# EAGLE schematic main (EAGLE 6.1)
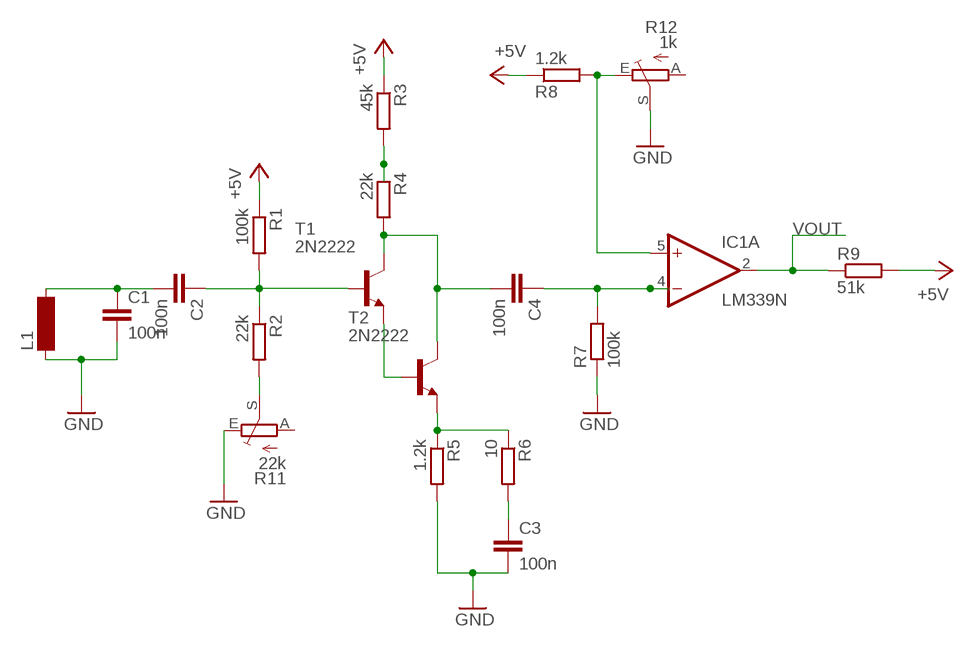
[diagram p0: schematic, sheet 1]

## Parts
C1  100n  C-EU025-024X044  [C025-024X044]
C2  100n  C-EU025-024X044  [C025-024X044]
C3  100n  C-EU025-024X044  [C025-024X044]
C4  100n  C-EU025-024X044  [C025-024X044]
IC1  LM339N  [DIL14]
L1  BS11  [BS11]
R1  100k  R-EU_0204/2V  [0204V]
R2  22k  R-EU_0204/2V  [0204V]
R3  45k  R-EU_0204/2V  [0204V]
R4  22k  R-EU_0204/2V  [0204V]
R5  1.2k  R-EU_0204/2V  [0204V]
R6  10  R-EU_0204/2V  [0204V]
R7  100k  R-EU_0204/2V  [0204V]
R8  1.2k  R-EU_0204/2V  [0204V]
R9  51k  R-EU_0204/2V  [0204V]
R11  22k  TRIM_EU-B25P  [B25P]
R12  1k  TRIM_EU-B25P  [B25P]
T1  2N2222  [TO18]
T2  2N2222  [TO18]

## Nets
+5V: R1.1 R3.1 R8.1 R9.2
GND: C1.2 C3.2 L1.1 R5.2 R7.1 R11.E R12.S
N$1: C1.1 C2.2 L1.2
N$2: R2.2 R11.S
N$3: C2.1 R1.2 R2.1 T1.2(B)
N$4: R3.2 R4.1
N$6: IC1.5(A:+IN) R8.2 R12.E
N$7: T1.1(E) T2.2(B)
N$8: C4.1 IC1.4(A:-IN) R7.2
N$9: R5.1 R6.1 T2.1(E)
N$10: C3.1 R6.2
N$11: C4.2 R4.2 T1.3(C) T2.3(C)
VOUT: IC1.2(A:OUT) R9.1
Unconnected: IC1.1(B:OUT) IC1.6(B:-IN) IC1.7(B:+IN) IC1.8(C:-IN) IC1.9(C:+IN) IC1.10(D:-IN) IC1.11(D:+IN) IC1.13(D:OUT) IC1.14(C:OUT) R11.A R12.A

## Power pins joined to a net without a drawn wire
GND: IC1.12(P:GND)
V+: IC1.3(P:V+)

## Library data of the parts
C1-C4 = rcl:C-EU: CAPACITOR, European symbol
IC1 = linear:LM339: Low Power Low Offset Voltage Quad Comparators with open collector; LM139/LM239/LM339/LM2901/LM3302
L1 = inductor-neosid:BS: INDUCTOR nominal inductance, magnetically screened; OC_FARNELL: unknown; OC_NEWARK: unknown
R1-R9 = rcl:R-EU_: RESISTOR, European symbol
R11 R12 = pot:TRIM_EU-: POTENTIOMETER
T1 T2 = transistor:2N2222: NPN TRANSISTOR